# EAGLE design emonTx4-ESP8266 (EAGLE 9.6.2)
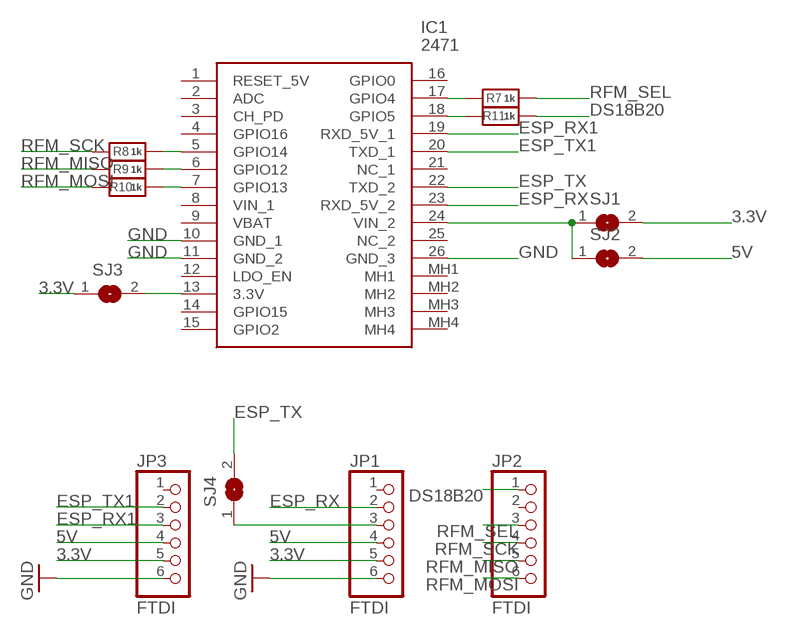
[diagram p0: schematic, sheet 1]

## Parts
IC1  2471  [2471]
JP1  FTDI  HEADER-1X670MIL  [1X06_ROUND_70]
JP2  FTDI  HEADER-1X670MIL  [1X06_ROUND_70]
JP3  FTDI  HEADER-1X670MIL  [1X06_ROUND_70]
R7  1k  RESISTOR_0603  [_0603]
R8  1k  RESISTOR_0603  [_0603]
R9  1k  RESISTOR_0603  [_0603]
R10  1k  RESISTOR_0603  [_0603]
R11  1k  RESISTOR_0603  [_0603]
SJ1  SJ  [SJ]
SJ2  SJ  [SJ]
SJ3  SJ  [SJ]
SJ4  SJ  [SJ]

## Nets
3.3V: JP1.5 JP3.5 SJ1.2 SJ3.1
5V: JP1.4 JP3.4 SJ2.2
DS18B20: JP2.1 R11.1
ESP_RX: IC1.23(RXD_5V_2) JP1.2
ESP_RX1: IC1.19(RXD_5V_1) JP3.3
ESP_TX: IC1.22(TXD_2) SJ4.2
ESP_TX1: IC1.20(TXD_1) JP3.2
GND: IC1.10(GND_1) IC1.11(GND_2) IC1.26(GND_3) JP1.6 JP3.6
N$1: JP1.3 SJ4.1
N$6: IC1.24(VIN_2) SJ1.1 SJ2.1
N$7: IC1.13(3.3V) SJ3.2
N$8: IC1.17(GPIO4) R7.2
N$9: IC1.5(GPIO14) R8.1
N$10: IC1.6(GPIO12) R9.1
N$11: IC1.7(GPIO13) R10.1
N$12: IC1.18(GPIO5) R11.2
RFM_MISO: JP2.5 R9.2
RFM_MOSI: JP2.6 R10.2
RFM_SCK: JP2.4 R8.2
RFM_SEL: JP2.3 R7.1
Unconnected: IC1.1(RESET_5V) IC1.2(ADC) IC1.3(CH_PD) IC1.4(GPIO16) IC1.8(VIN_1) IC1.9(VBAT) IC1.12(LDO_EN) IC1.14(GPIO15) IC1.15(GPIO2) IC1.16(GPIO0) IC1.21(NC_1) IC1.25(NC_2) IC1.MH1 IC1.MH2 IC1.MH3 IC1.MH4 JP1.1 JP2.2 JP3.1

## Library data of the parts
IC1 = 2471:2471: WiFi / 802.11 Development Tools HUZZAH ESP8266 Breakout Source: Datasheet <https://www.adafruit.com/product/2471>; ARROW_PART_NUMBER: 2471; ARROW_PRICE-STOCK: https://www.arrow.com/en/products/2471/adafruit-industries?region=nac; DESCRIPTION: WiFi / 802.11 Development Tools HUZZAH ESP8266 Breakout; HEIGHT: 3mm; MANUFACTURER_NAME: Adafruit; MANUFACTURER_PART_NUMBER: 2471; MOUSER_PART_NUMBER: 485-2471; MOUSER_PRICE-STOCK: https://www.mouser.co.uk/ProductDetail/Adafruit/2471?qs=GURawfaeGuAoxPWz4nSJYg%3D%3D
JP1-JP3 = microbuilder:HEADER-1X6: PIN HEADER
R7-R11 = microbuilder:RESISTOR: Resistors For new designs, use the packages preceded by an '_' character since they are more reliable: The following footprints should be used on most boards: _0402 - Standard footprint for regular board layouts _0603 - Standard footprint for regular board layouts _0805 - Standard footprint for regular board layouts _1206 - Standard footprint for regular board layouts For extremely tight-pitch boards where space is at a premium, the following 'micro-pitch' footprints can be used (smaller pads, no silkscreen outline, etc.): _0402MP - Micro-pitch footprint for very dense/compact boards _0603MP - Micro-pitch footprint for very dense/compact boards _0805MP - Micro-pitch footprint for very dense/compact boards _1206MP - Micro-pitch footprint for very dense/compact boards
SJ1-SJ4 = jumper:SJ: SMD solder JUMPER

## Net classes
1 power: width 0.254 mm, drill 0.5 mm, clearance 0.152 mm
2 gnd: width 0.254 mm, drill 0.5 mm, clearance 0.152 mm

## Board
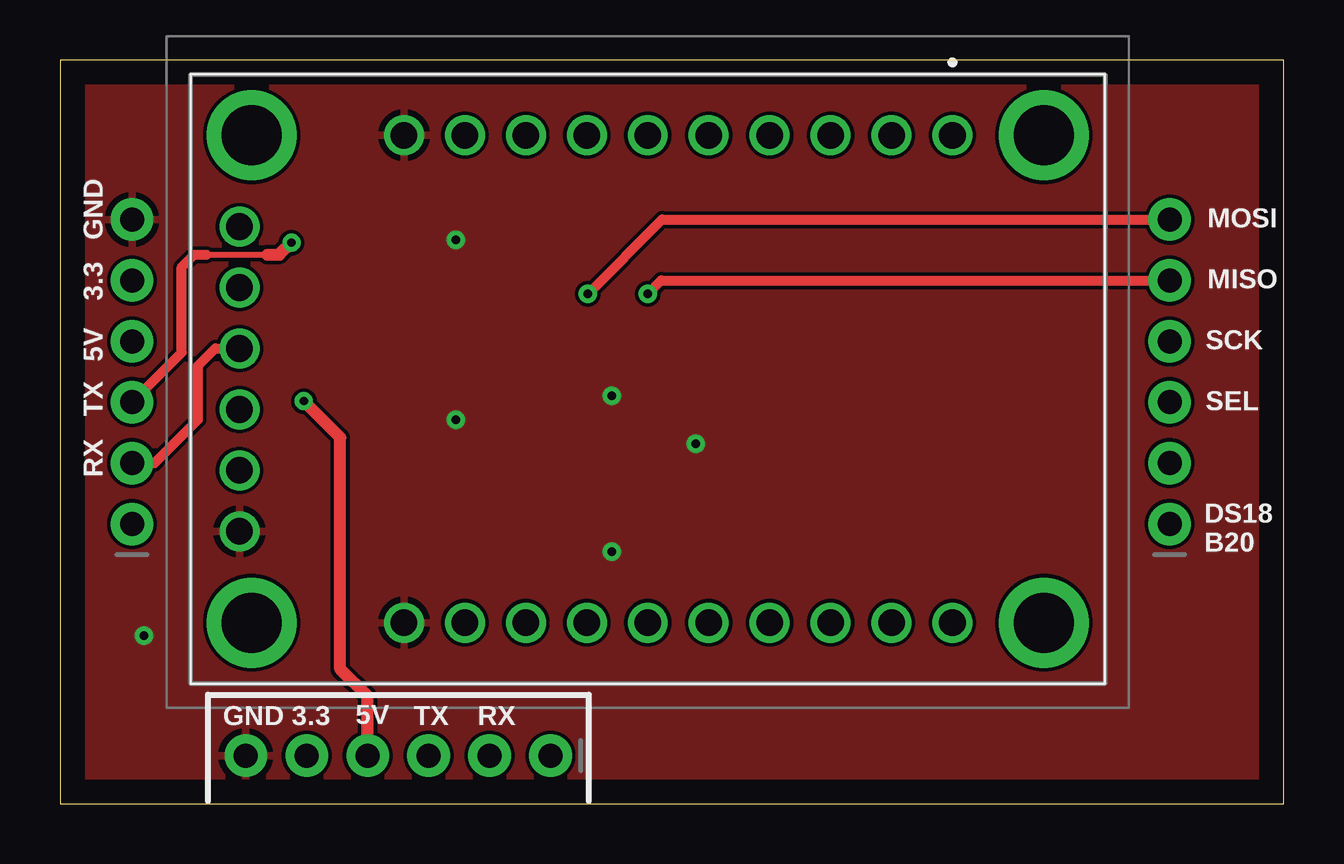
[diagram p1: board, top side]
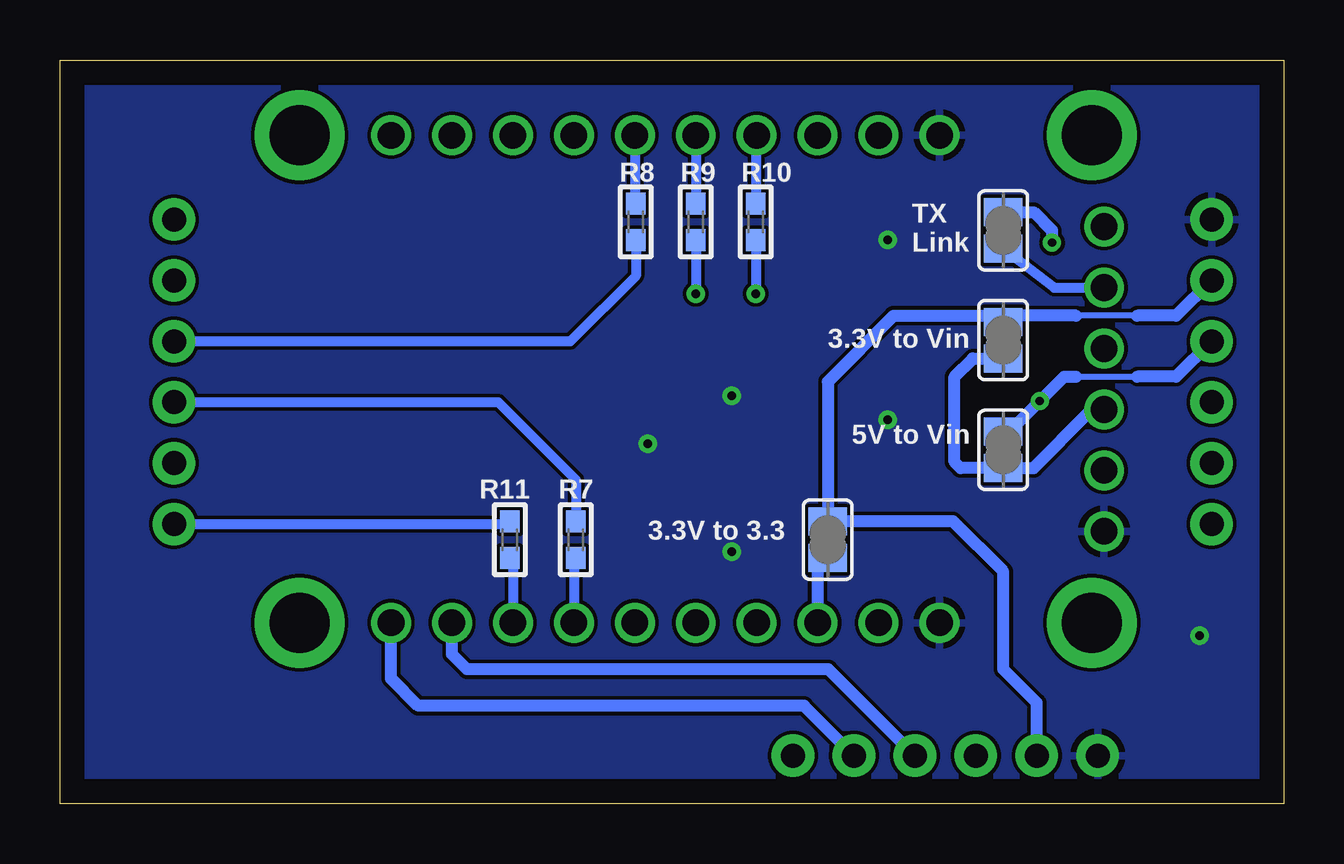
[diagram p2: board, bottom side, seen from below]

Size 51 x 31 mm. Coordinates in mm from the lower left corner, seen from the top.
Outline: 51,31 0,31 0,0 51,0 51,31
Copper layers (1*16): Top 0.035mm / dielectric 1.5mm / Bottom 0.035mm
Design rules "default *": minimum track width 6mil, minimum drill 0.35mm, track to track 6mil, track to pad 6mil, pad to pad 6mil, via to via 6mil, smd to smd 6mil, copper to edge 40mil, drill to drill 6mil, minimum pad ring 10mil, minimum via ring 8mil, stop-mask expansion 4mil, vias tented up to drill 0.6mm, thermal gap 10mil

### Footprints (pad centres in the part's own frame; a part is rotated, then mirrored left to right if it is on the bottom)
2471 = drill 1.11 pad 1.665: 1 12.7,9.86; 2 10.16,9.86; 3 7.62,9.86; 4 5.08,9.86; 5 2.54,9.86; 6 0,9.86; 7 -2.54,9.86; 8 -5.08,9.86; 9 -7.62,9.86; 10 -10.16,9.86; 11 -10.16,-10.46; 12 -7.62,-10.46; 13 -5.08,-10.46; 14 -2.54,-10.46; 15 0,-10.46; 16 2.54,-10.46; 17 5.08,-10.46; 18 7.62,-10.46; 19 10.16,-10.46; 20 12.7,-10.46; 21 -17.02,6.05; 22 -17.02,3.51; 23 -17.02,0.97; 24 -17.02,-1.57; 25 -17.02,-4.11; 26 -17.02,-6.65 | drill 2.5 pad 3.75: MH1 -16.51,-10.46; MH2 -16.51,9.86; MH3 16.51,9.86; MH4 16.51,-10.46
1X06_ROUND_70 = drill 1 pad 1.778: 1 -6.35,0; 2 -3.81,0; 3 -1.27,0; 4 1.27,0; 5 3.81,0; 6 6.35,0
_0603 = smd 0.9 x 0.8: 1 -0.762,0; 2 0.762,0
SJ = smd 1.168 x 1.6: 1 -0.762,0; 2 0.762,0

### Placement (x,y rotation side)
IC1  24.5,18 0 top
JP1  3,18 90 top
JP2  46.25,18 90 top
JP3  14.1,2 180 top
R7  29.5,11 270 bottom
R8  27,24.25 270 bottom
R9  24.5,24.25 270 bottom
R10  22,24.25 270 bottom
R11  32.25,11 270 bottom
SJ1  11.68,19.32 90 bottom
SJ2  11.68,14.75 90 bottom
SJ3  19,11 270 bottom
SJ4  11.68,23.89 270 bottom

### Tracks (layer width: path | path; a pad name or v marks a point on that pad's centre or on a via)
3.3V
  Bottom 0.254: 6.1,20.34 8.64,20.34
  Bottom 0.508: JP1.5 4.47,20.34 6.1,20.34 | 8.64,20.34 11.43,20.34 SJ1.2 11.94,20.34 16.26,20.34 19,17.59 SJ3.1 13.78,11.76 11.68,9.67 11.68,5.6 10.29,4.21 JP3.5
5V  (via drill 0.35)
  Top 0.508: JP3.4 12.83,4.46 11.68,5.6 11.68,15.26 v10.16,16.78
  Bottom 0.254: 8.64,17.8 6.1,17.8
  Bottom 0.508: JP1.4 4.47,17.8 6.1,17.8 | 8.64,17.8 9.14,17.8 v10.16,16.78 11.43,15.51 SJ2.2
DS18B20
  Bottom 0.406: JP2.1 32.36,11.65 R11.1
ESP_RX
  Top 0.406: JP1.2 3.94,14.19 5.76,16.01 5.76,18.26 6.47,18.97 IC1.23 7.51,19
ESP_RX1
  Bottom 0.508: JP3.3 18.97,5.6 34.04,5.6 34.66,6.23 IC1.19
ESP_TX
  Bottom 0.406: SJ4.2 9.56,21.51 IC1.22
ESP_TX1
  Top 0.406: 17.9,2.01 JP3.2
  Bottom 0.508: JP3.2 19.99,4.08 36.07,4.08 37.2,5.21 IC1.20
GND  (via drill 0.35)
  other vias: 23,17 26.5,15 16.5,16 16.5,23.5 23,10.5 3.5,7
  pour Top: -1.27,34.4 -1.27,-3.17 52.07,-3.17 52.07,34.4
  pour Bottom: -0.64,33.52 -0.64,-2.54 51.44,-2.54 51.44,33.52
N$1  (via drill 0.35)
  Top 0.254: 6.1,22.88 8.64,22.88
  Top 0.406: JP1.3 5.08,18.81 5.08,22.37 5.59,22.88 6.1,22.88
  Top 0.508: v9.65,23.38 9.14,22.88 8.64,22.88
  Bottom 0.406: 3.61,16.73 JP1.3
  Bottom 0.508: SJ4.1 10.41,24.65 9.65,23.89 v9.65,23.38
N$6
  Bottom 0.508: IC1.24 7.64,16.27 8.13,16.27 10.41,13.99 SJ2.1 13.46,13.99 13.72,14.24 13.72,17.8 12.95,18.56 SJ1.1
N$7
  Bottom 0.508: SJ3.2 19.42,9.82 IC1.13
N$8
  Bottom 0.406: R7.2 29.58,10.16 IC1.17
N$9
  Bottom 0.406: IC1.5 27.04,25.05 R8.1
N$10
  Bottom 0.406: IC1.6 R9.1
N$11
  Bottom 0.406: IC1.7 22,27.82 R10.1
N$12
  Bottom 0.406: R11.2 32.12,10.11 IC1.18
RFM_MISO  (via drill 0.35)
  Top 0.406: v24.5,21.25 25.06,21.81 JP2.5
  Bottom 0.406: R9.2 v24.5,21.25
RFM_MOSI  (via drill 0.35)
  Top 0.406: v22,21.25 25.1,24.35 JP2.6
  Bottom 0.406: R10.2 v22,21.25
RFM_SCK
  Bottom 0.406: R8.2 27,22 29.73,19.27 JP2.4
RFM_SEL
  Bottom 0.406: JP2.3 32.73,16.73 29.5,13.5 R7.1

### Text on the board
tNames: GND | MOSI | 3.3 | MISO | SCK | 5V | TX | SEL | RX | DS18 / B20 | GND | 3.3 | 5V | TX | RX
bNames: TX / Link | 3.3V to Vin | 5V to Vin | 3.3V to 3.3